# EAGLE design refgen (EAGLE 7.6.0)
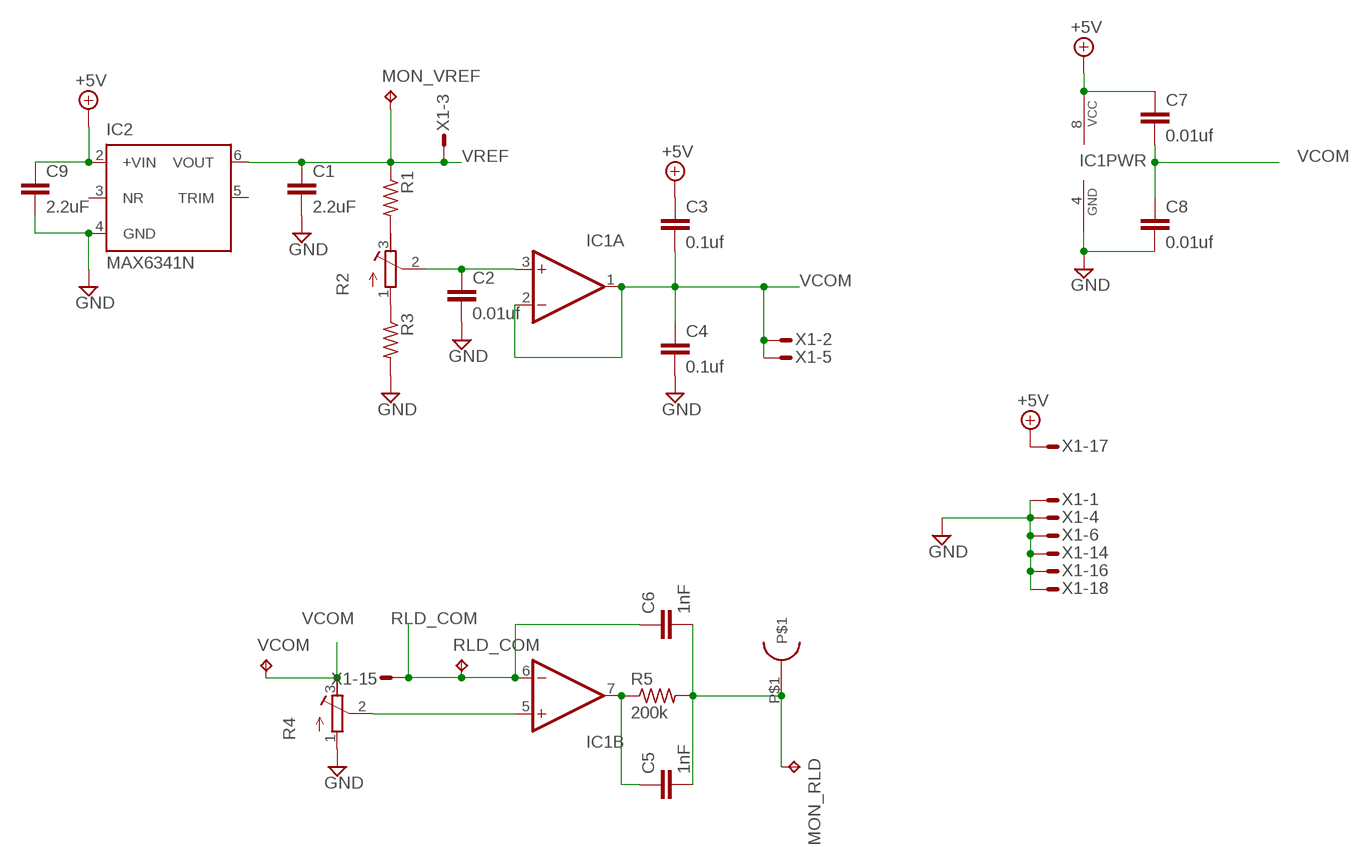
[diagram p0: schematic, sheet 1]

## Parts
C1  2.2uF  C-EU050-025X075  [C050-025X075]
C2  0.01uf  C-EU050-025X075  [C050-025X075]
C3  0.1uf  C-EU050-025X075  [C050-025X075]
C4  0.1uf  C-EU050-025X075  [C050-025X075]
C5  1nF  C-EU050-025X075  [C050-025X075]
C6  1nF  C-EU050-025X075  [C050-025X075]
C7  0.01uf  C-EU050-025X075  [C050-025X075]
C8  0.01uf  C-EU050-025X075  [C050-025X075]
C9  2.2uF  C-EU050-025X075  [C050-025X075]
IC1  TLC277P  [DIL-08]
IC2  MAX6341N  [DIL08]
MON_RLD  TPPAD1-17  [P1-17]
MON_VREF  TPPAD1-17  [P1-17]
R1  R-US_0204/2V  [0204V]
R2  R-TRIMM3296W  [RTRIM3296W]
R3  R-US_0204/2V  [0204V]
R4  R-TRIMM3296W  [RTRIM3296W]
R5  200k  R-US_0204/2V  [0204V]
RLD_COM  TPPAD1-17  [P1-17]
RLD_OUT  DIN42802  [DIN42802]
VCOM  TPPAD1-17  [P1-17]
X1  M25HPS  [M25HP]

## Nets
+5V: C3.1 C7.1 C9.1 IC1.8(PWR:VCC) IC2.2(+VIN) X1.17
GND: C1.2 C2.2 C4.2 C8.2 C9.2 IC1.4(PWR:GND) IC2.4(GND) R3.2 R4.1(A) X1.1 X1.4 X1.6 X1.14 X1.16 X1.18
N$1: C5.1 IC1.7(B:OUT) R5.1
N$2: R1.2 R2.3(E)
N$3: R2.1(A) R3.1
N$4: C2.1 IC1.3(A:+IN) R2.2(S)
N$5: C5.2 C6.2 MON_RLD.TP R5.2 RLD_OUT.P$1
N$6: IC1.5(B:+IN) R4.2(S)
RLD_COM: C6.1 IC1.6(B:-IN) RLD_COM.TP X1.15
VCOM: C3.2 C4.1 C7.2 C8.1 IC1.1(A:OUT) IC1.2(A:-IN) R4.3(E) VCOM.TP X1.2 X1.5
VREF: C1.1 IC2.6(VOUT) MON_VREF.TP R1.1 X1.3
Unconnected: IC2.3(NR) IC2.5(TRIM) X1.7 X1.8 X1.9 X1.10 X1.11 X1.12 X1.13 X1.19 X1.20 X1.21 X1.22 X1.23 X1.24 X1.25

## Library data of the parts
C1-C9 = resistor:C-EU: CAPACITOR, European symbol
IC1 = BURR:TLC277P
IC2 = EEG:MAX6341: High Precision Reference 2.5V/3.0V Source: http://www.analog.com/UploadedFiles/Data_Sheets/AD780.pdf; MF: ALTERA CORPORATION; MPN: AD780ANZ; OC_FARNELL: 9605550; OC_NEWARK: 59K5478
MON_RLD MON_VREF RLD_COM VCOM = testpad:TP: Test pad
R1 R3 R5 = resistor:R-US_: RESISTOR, American symbol
R2 R4 = resistor:R-TRIMM: Trimm resistor
RLD_OUT = modEEG:DIN42802
X1 = con-subd:M25?S: SUB-D; OC_FARNELL: unknown; OC_NEWARK: unknown

## Board
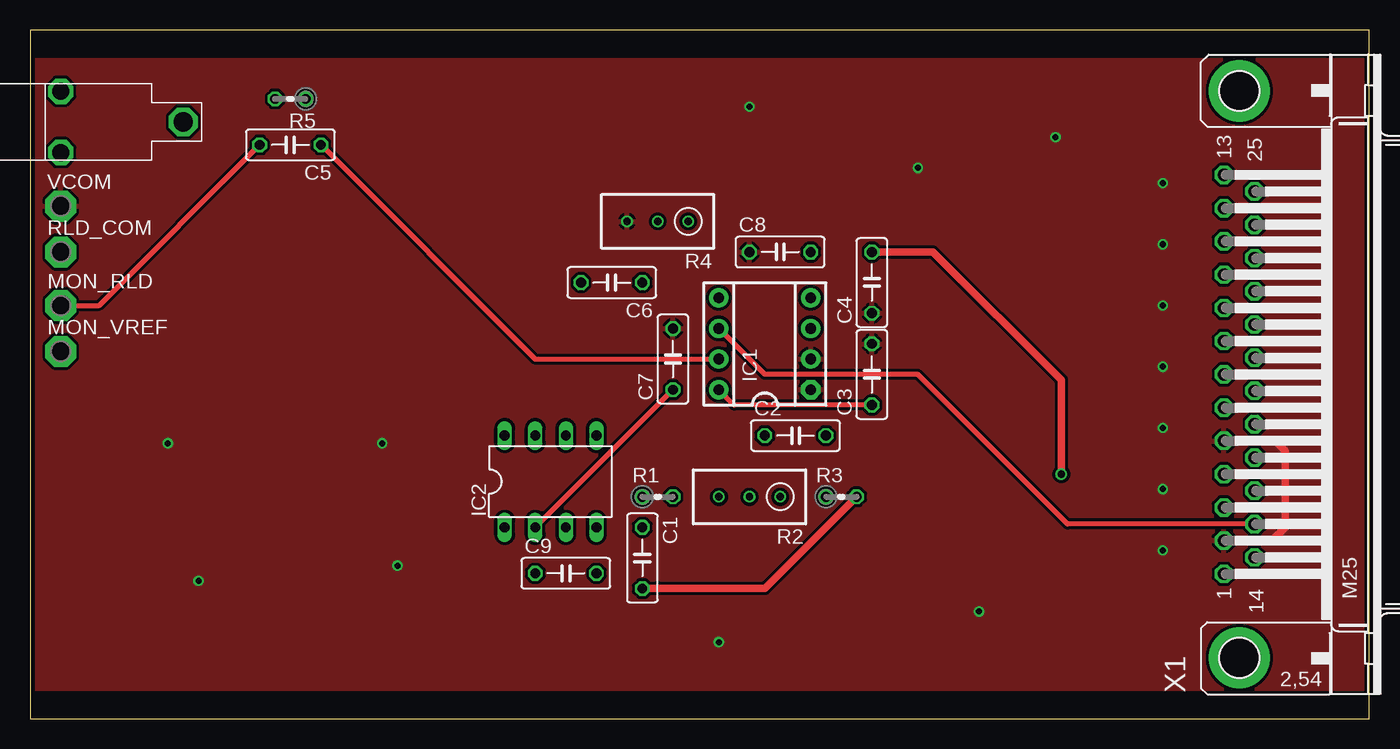
[diagram p1: board, top side]
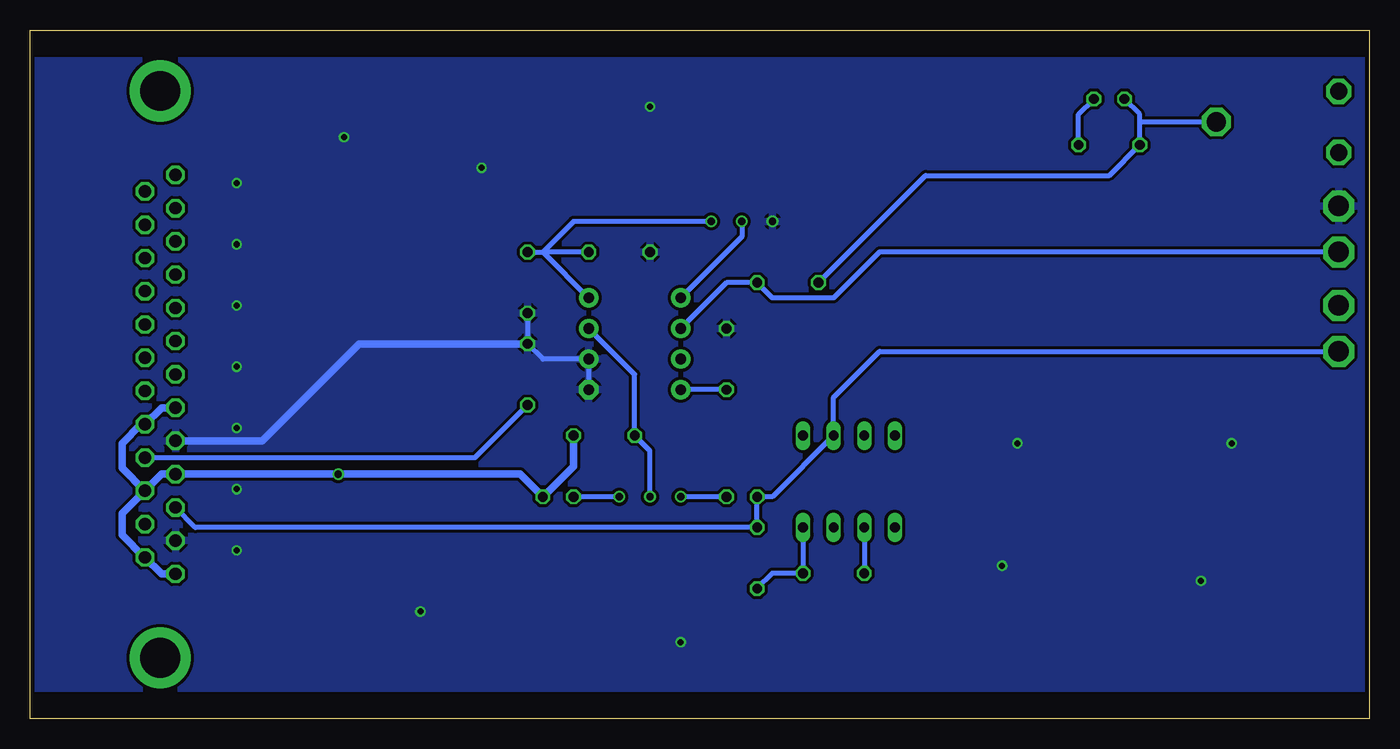
[diagram p2: board, bottom side, seen from below]

Size 111.12 x 57.15 mm. Coordinates in mm from the lower left corner, seen from the top.
Outline: 0,0 111.12,0 111.12,57.15 0,57.15 0,0
Copper layers (1*16): Top 0.0356mm / dielectric 1.5011mm / Bottom 0.0356mm
Design rules "Oshpark": minimum track width 6mil, minimum drill 13mil, track to track 6mil, track to pad 6mil, pad to pad 6mil, via to via 6mil, smd to smd 6mil, copper to edge 15mil, drill to drill 6mil, minimum pad ring 7mil, minimum via ring 7mil, stop-mask expansion 3mil, vias tented up to drill 0mil, thermal gap 10mil

### Footprints (pad centres in the part's own frame; a part is rotated, then mirrored left to right if it is on the bottom)
C050-025X075 = drill 0.813 octagon: 1 -2.54,0; 2 2.54,0
DIL-08 = drill 0.889 pad 1.6 octagon: 1 -3.81,-3.81 | drill 0.889 pad 1.6: 2 -1.27,-3.81; 3 1.27,-3.81; 4 3.81,-3.81; 5 3.81,3.81; 6 1.27,3.81; 7 -1.27,3.81; 8 -3.81,3.81
DIL08 = drill 0.813 long: 1 -3.81,-3.81; 2 -1.27,-3.81; 3 1.27,-3.81; 4 3.81,-3.81; 5 3.81,3.81; 6 1.27,3.81; 7 -1.27,3.81; 8 -3.81,3.81
P1-17 = drill 1.702 pad 2.54 octagon: TP 0,0
0204V = drill 0.813 octagon: 1 -1.27,0; 2 1.27,0
RTRIM3296W = drill 0.61: 1 0,-2.54; 2 0,0; 3 0,2.54
DIN42802 = drill 1.4 octagon: MNT -2.54,0; MNT@1 2.54,0 | drill 1.6 octagon: P$1 0,-10.16
M25HP = drill 1.016 octagon: 1 -16.561,1.27; 2 -13.792,1.27; 3 -11.049,1.27; 4 -8.28,1.27; 5 -5.512,1.27; 6 -2.769,1.27; 7 0,1.27; 8 2.769,1.27; 9 5.512,1.27; 10 8.28,1.27; 11 11.049,1.27; 12 13.792,1.27; 13 16.561,1.27; 14 -15.189,-1.27; 15 -12.421,-1.27; 16 -9.652,-1.27; 17 -6.909,-1.27; 18 -4.14,-1.27; 19 -1.372,-1.27; 20 1.372,-1.27; 21 4.14,-1.27; 22 6.909,-1.27; 23 9.652,-1.27; 24 12.421,-1.27; 25 15.189,-1.27 | drill 3.302 pad 5.08: G1 -23.52,0; G2 23.52,0

### Placement (x,y rotation side)
C1  50.8,13.34 270 top
C2  63.5,23.5 0 top
C3  69.85,28.57 90 top
C4  69.85,36.2 90 top
C5  21.59,47.62 180 top
C6  48.26,36.2 180 top
C7  53.34,29.84 90 top
C8  62.23,38.73 0 top
C9  44.45,12.06 0 top
IC1  60.96,31.11 90 top
IC2  43.18,19.68 0 top
MON_RLD  2.54,34.29 0 top
MON_VREF  2.54,30.48 0 top
R1  52.07,18.41 0 top
R2  59.69,18.41 90 top
R3  67.31,18.41 0 top
R4  52.07,41.27 90 top
R5  21.59,51.44 180 top
RLD_COM  2.54,38.73 0 top
RLD_OUT  2.54,49.53 90 top
VCOM  2.54,42.55 0 top
X1  100.33,28.57 90 top

### Tracks (layer width: path | path; a pad name or v marks a point on that pad's centre or on a via)
+5V
  Top 0.406: C3.1 58.42,26.04 IC1.8 | IC2.2 C7.1
  Bottom 0.406: IC2.2 C9.1 | C7.1 IC1.8 | X1.17 74.22,21.67 C3.1
GND  (via drill 0.6)
  Top 0.61: v85.57,20.3 85.57,28.1 74.93,38.73 C4.2 | C1.2 60.96,10.79 R3.2
  Bottom 0.406: C4.2 68.58,38.73 | 68.58,38.73 IC1.4 | IC2.4 C9.2 49.53,12.06 C1.2 | C8.2 68.58,38.73 | R4.1 66.04,41.27 68.58,38.73
  Bottom 0.61: X1.1 100.23,12.01 X1.14 101.65,13.39 103.5,15.24 103.5,17.02 X1.16 | X1.16 100.23,20.3 X1.4 v85.57,20.3 70.46,20.3 R3.2 66.04,20.95 C2.2 | X1.6 100.23,25.81 X1.18 101.93,24.43 103.5,22.86 103.5,20.83 X1.16
N$1
  Top 0.406: C5.1 41.91,29.84 IC1.7
  Bottom 0.406: C5.1 24.13,50.16 R5.1
N$2
  Bottom 0.406: R1.2 R2.3
N$3
  Bottom 0.406: R2.1 R3.1
N$4
  Bottom 0.406: R2.2 59.69,22.23 C2.1 60.96,28.57 IC1.3
N$5
  Top 0.406: MON_RLD.TP 5.71,34.29 C5.2
  Bottom 0.406: 19.05,49.53 C5.2 21.59,45.09 36.83,45.09 C6.2 | 19.05,49.53 19.05,50.16 R5.2 | RLD_OUT.P$1 19.05,49.53
N$6
  Bottom 0.406: R4.2 52.07,40.01 IC1.5
RLD_COM
  Top 0.406: X1.15 86.08,16.15 73.66,28.57 60.96,28.57 IC1.6
  Bottom 0.406: RLD_COM.TP 40.64,38.73 44.45,34.92 49.53,34.92 C6.1 53.34,36.2 IC1.6
VCOM  (via drill 0.5)
  Top 0.61: X1.2 103.05,14.78 104.14,15.88 104.14,22.23 103.3,23.06 X1.5
  Bottom 0.406: IC1.1 IC1.2 68.58,29.84 C3.2 C4.1
  Bottom 0.61: X1.5 91.87,23.06 83.82,31.11 C3.2
  other vias: 93.98,13.97 93.98,19.05 93.98,24.13 93.98,29.21 93.98,34.29 93.98,39.37 93.98,44.45 85.09,48.26 73.66,45.72 59.69,50.8 78.74,8.89 57.15,6.35 30.48,12.7 29.21,22.86 13.97,11.43 11.43,22.86
  pour Bottom (isolate 0.254): -8.89,54.61 121.92,54.61 121.92,2.54 -8.89,2.54
  pour Top (isolate 0.254): -8.89,54.61 -8.89,2.54 125.73,2.54 125.73,54.61
VREF
  Bottom 0.406: X1.3 97.41,15.88 C1.1 R1.1 49.53,18.41 IC2.6 44.45,26.67 40.64,30.48 MON_VREF.TP